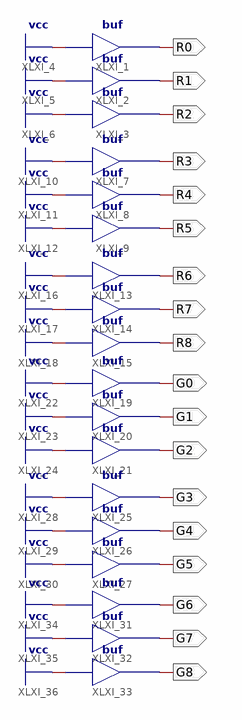
[diagram p0: schematic sheet 1]
// Xilinx ISE schematic main.sch (spartan6) as structural Verilog: 18 symbols, 18 ports
module main (
  output R2,
  output R1,
  output R0,
  output R3,
  output R4,
  output R5,
  output R6,
  output R7,
  output R8,
  output G0,
  output G1,
  output G2,
  output G3,
  output G4,
  output G5,
  output G6,
  output G7,
  output G8
);

  buf XLXI_3 (R2, 1'b1);
  buf XLXI_2 (R1, 1'b1);
  buf XLXI_1 (R0, 1'b1);
  buf XLXI_7 (R3, 1'b1);
  buf XLXI_8 (R4, 1'b1);
  buf XLXI_9 (R5, 1'b1);
  buf XLXI_13 (R6, 1'b1);
  buf XLXI_14 (R7, 1'b1);
  buf XLXI_15 (R8, 1'b1);
  buf XLXI_19 (G0, 1'b1);
  buf XLXI_20 (G1, 1'b1);
  buf XLXI_21 (G2, 1'b1);
  buf XLXI_25 (G3, 1'b1);
  buf XLXI_26 (G4, 1'b1);
  buf XLXI_27 (G5, 1'b1);
  buf XLXI_31 (G6, 1'b1);
  buf XLXI_32 (G7, 1'b1);
  buf XLXI_33 (G8, 1'b1);
endmodule
